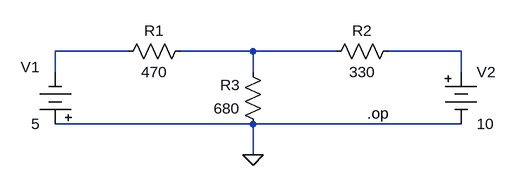
[diagram p0: schematic KVL.asc]
KVL.asc, the LTspice schematic file:
Version 4
SHEET 1 880 680
WIRE -48 112 -160 112
WIRE 144 112 32 112
WIRE 272 112 144 112
WIRE 464 112 352 112
WIRE -160 144 -160 112
WIRE 144 144 144 112
WIRE 464 144 464 112
WIRE 144 224 -160 224
WIRE 464 224 144 224
WIRE 144 272 144 224
FLAG 144 272 0
DATAFLAG 144 112 ""
DATAFLAG 272 112 "$-V(N003)"
DATAFLAG -160 112 "$-V(N002)"
SYMBOL res 48 96 R90
WINDOW 0 0 56 VBottom 2
WINDOW 3 32 56 VTop 2
SYMATTR InstName R1
SYMATTR Value 470
SYMBOL res 368 96 R90
WINDOW 0 0 56 VBottom 2
WINDOW 3 32 56 VTop 2
SYMATTR InstName R2
SYMATTR Value 330
SYMBOL res 160 240 R180
WINDOW 0 36 76 Left 2
WINDOW 3 36 40 Left 2
SYMATTR InstName R3
SYMATTR Value 680
SYMBOL Misc\\battery -160 240 R180
WINDOW 0 24 104 Left 2
WINDOW 3 24 16 Left 2
SYMATTR InstName V1
SYMATTR Value 5
SYMBOL Misc\\battery 464 128 R0
SYMATTR InstName V2
SYMATTR Value 10
TEXT 320 208 Left 2 !.op

The netlist it stands for:
* KVL.asc
R1 N002 N001 470
R2 N003 N002 330
R3 0 N002 680
V1 0 N001 5
V2 N003 0 10
.op
.backanno
.end